# Altium schematic sheet Energy Meter.SchDoc
size A
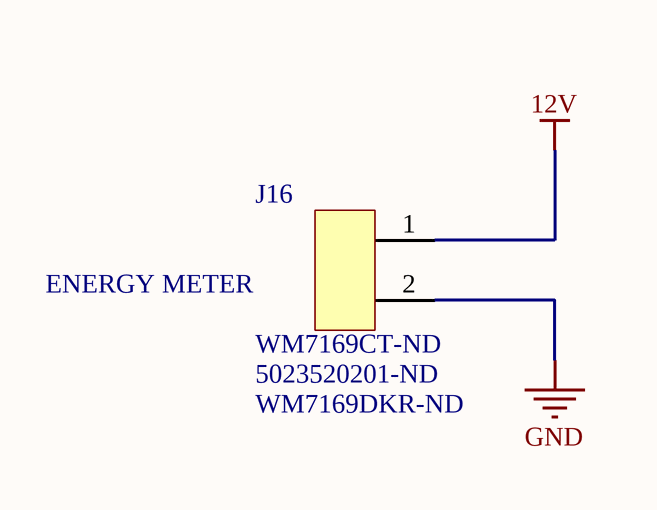
[diagram p0: Energy Meter.SchDoc]

## Parts
J16  Supplier Part Number 1: 5023520201-ND  Supplier Part Number 2: WM7169DKR-ND  [MOLEX_DURACLIK_2]  (hidden comment: J_5023520200)

## Nets
12V: J16.1
GND: J16.2

## Notes on the sheet
- ENERGY METER

## Library data of the parts
J16 = J_5023520200: MOLEX DURACLIK 2-PIN RA; Digikey_PN: WM7169CT-ND; Supplier 1: Digi-Key; Supplier 2: Digi-Key